# EAGLE schematic untitled (EAGLE 7.2.0)
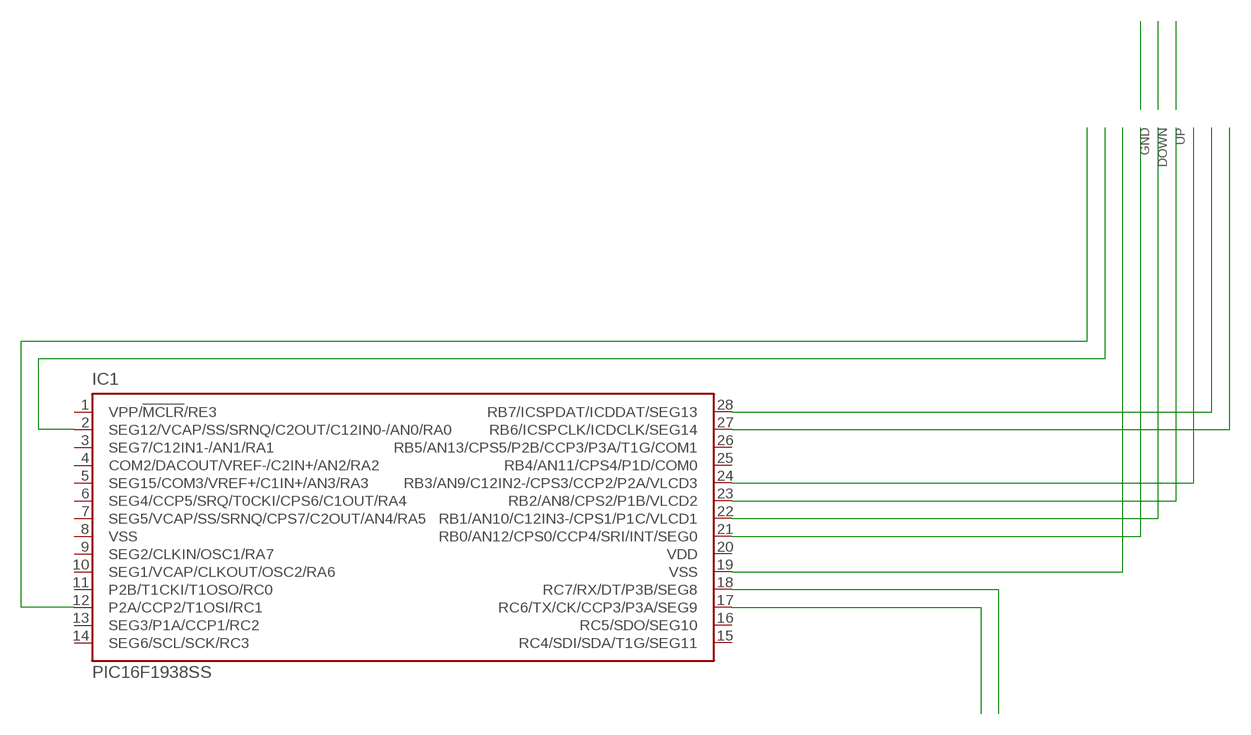
[diagram p0: schematic, sheet 1]

## Parts
IC1  PIC16F1938SS  [SSOP28]

## Nets
DOWN: IC1.22(RB1/AN10/C12IN3-/CPS1/P1C/VLCD1)
GND: IC1.21(RB0/AN12/CPS0/CCP4/SRI/INT/SEG0)
N$1: IC1.27(RB6/ICSPCLK/ICDCLK/SEG14)
N$2: IC1.28(RB7/ICSPDAT/ICDDAT/SEG13)
N$3: IC1.24(RB3/AN9/C12IN2-/CPS3/CCP2/P2A/VLCD3)
N$4: IC1.18(RC7/RX/DT/P3B/SEG8)
N$5: IC1.17(RC6/TX/CK/CCP3/P3A/SEG9)
N$7: IC1.19(VSS)
N$8: IC1.2(SEG12/VCAP/SS/SRNQ/C2OUT/C12IN0-/AN0/RA0)
N$9: IC1.12(P2A/CCP2/T1OSI/RC1)
UP: IC1.23(RB2/AN8/CPS2/P1B/VLCD2)
Unconnected: IC1.1(VPP/!MCLR!/RE3) IC1.3(SEG7/C12IN1-/AN1/RA1) IC1.4(COM2/DACOUT/VREF-/C2IN+/AN2/RA2) IC1.5(SEG15/COM3/VREF+/C1IN+/AN3/RA3) IC1.6(SEG4/CCP5/SRQ/T0CKI/CPS6/C1OUT/RA4) IC1.7(SEG5/VCAP/SS/SRNQ/CPS7/C2OUT/AN4/RA5) IC1.9(SEG2/CLKIN/OSC1/RA7) IC1.10(SEG1/VCAP/CLKOUT/OSC2/RA6) IC1.11(P2B/T1CKI/T1OSO/RC0) IC1.13(SEG3/P1A/CCP1/RC2) IC1.14(SEG6/SCL/SCK/RC3) IC1.15(RC4/SDI/SDA/T1G/SEG11) IC1.16(RC5/SDO/SEG10) IC1.25(RB4/AN11/CPS4/P1D/COM0) IC1.26(RB5/AN13/CPS5/P2B/CCP3/P3A/T1G/COM1)

## Power pins joined to a net without a drawn wire
VDD: IC1.20(VDD)
VSS: IC1.8(VSS)

## Library data of the parts
IC1 = microchip:PIC16F19*: Flash-Based, 8-Bit CMOS Microcontrollers wtih LCD Driver and nanoWatt XLP Technology Auto generated by make-symbol-device-package-bsdl.ulp Rev. 33 Source: http://ww1.microchip.com/downloads/en/DeviceDoc/41364D.pdf; MPN: PIC16F1938-E/SS; OC_FARNELL: 1755830; OC_NEWARK: 08R1946